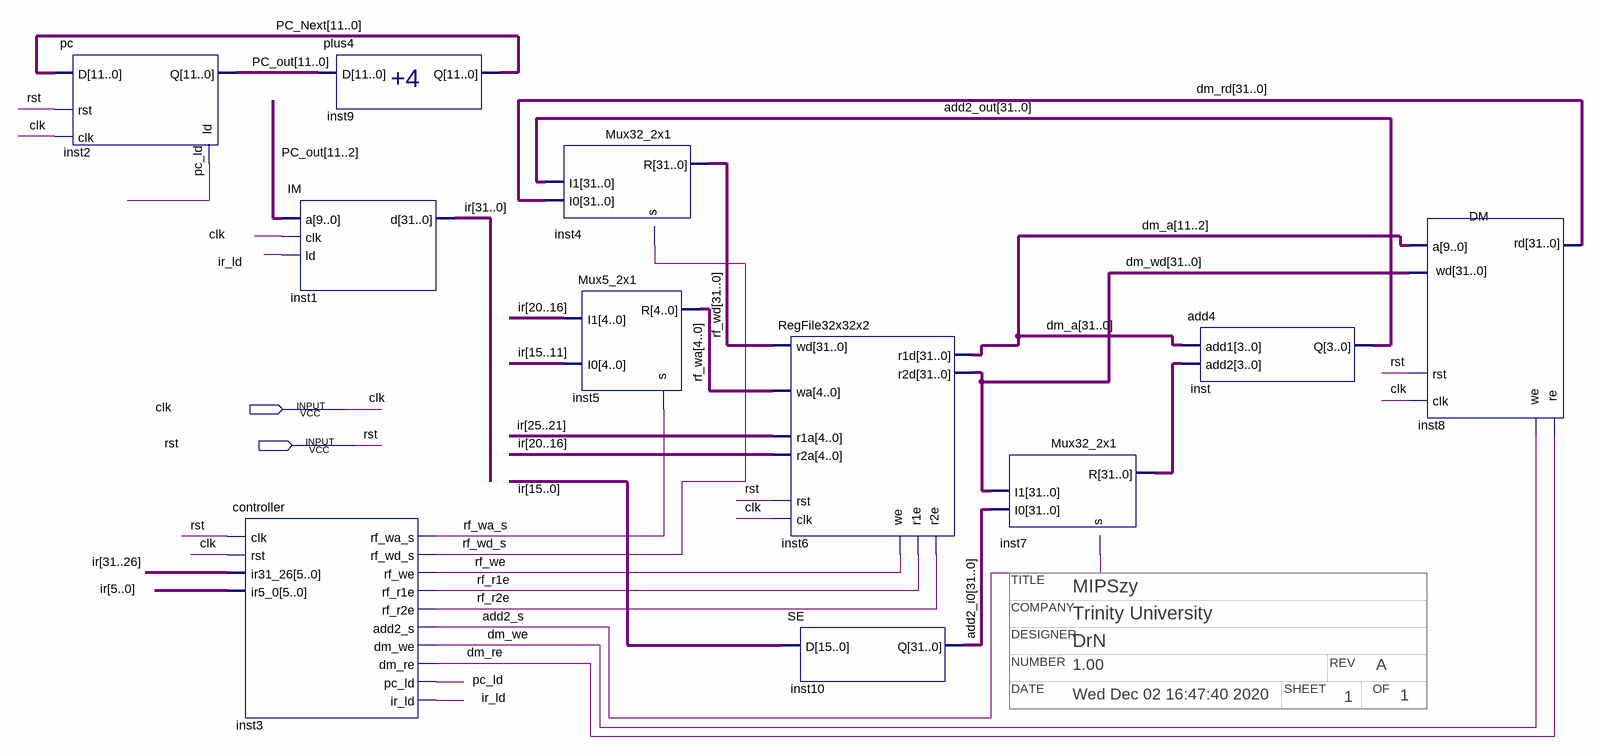
[diagram p0: schematic sheet]
// Quartus schematic top_mipszy_bdf.bdf as structural Verilog: 11 symbols, 2 pins
// Title block: TITLE: MIPSzy; COMPANY: Trinity University; DESIGNER: DrN; NUMBER: 1.00; REV: A; DATE: Wed Dec 02 16:47:40 2020; SHEET: 1; OF: 1
module top_mipszy_bdf (
  input  clk,
  input  rst
);

  wire add2_s, dm_re, dm_we, ir_ld, pc_ld, rf_r1e, rf_r2e, rf_wa_s, rf_wd_s, rf_we;
  wire [4:0] rf_wa;
  wire [11:0] PC_Next, PC_out;
  wire [31:0] add2_i0, add2_out, dm_a, dm_rd, dm_wd, inst7_r, ir, rf_wd;

  pc inst2 (.clk(clk), .rst(rst), .ld(pc_ld), .D(PC_Next), .Q(PC_out));
  controller inst3 (
    .clk(rst), .rst(clk), .ir31_26(ir[31:26]), .ir5_0(ir[5:0]), .rf_wa_s(rf_wa_s), .rf_wd_s(rf_wd_s),
    .rf_we(rf_we), .rf_r1e(rf_r1e), .rf_r2e(rf_r2e), .add2_s(add2_s), .dm_we(dm_we), .dm_re(dm_re),
    .pc_ld(pc_ld), .ir_ld(ir_ld));
  IM inst1 (.a(PC_out[11:2]), .clk(clk), .ld(ir_ld), .d(ir));
  plus4 inst9 (.D(PC_out), .Q(PC_Next));
  Mux32_2x1 inst4 (.I1(add2_out), .I0(dm_rd), .s(rf_wd_s), .R(rf_wd));
  Mux5_2x1 inst5 (.I1(ir[20:16]), .I0(ir[15:11]), .s(rf_wa_s), .R(rf_wa));
  RegFile32x32x2 inst6 (
    .r1e(rf_r1e), .r2e(rf_r2e), .we(rf_we), .wd(rf_wd), .clk(clk), .rst(rst), .wa(rf_wa), .r1a(ir[25:21]),
    .r2a(ir[20:16]), .r1d(dm_a), .r2d(dm_wd));
  SE inst10 (.D(ir[15:0]), .Q(add2_i0));
  Mux32_2x1 inst7 (.I1(dm_wd), .I0(add2_i0), .s(add2_s), .R(inst7_r));
  add4 inst (.add1(dm_a), .add2(inst7_r), .Q(add2_out));
  DM inst8 (.a(dm_a[11:2]), .rst(rst), .clk(clk), .re(dm_re), .we(dm_we), .wd(dm_wd), .rd(dm_rd));
endmodule
